# Altium schematic sheet Peripheral.SchDoc
size A3; Date: 01/12/2021; DrawnBy: Can Güveren; SheetNumber: 3; SheetTotal: 4; PageSize: A3
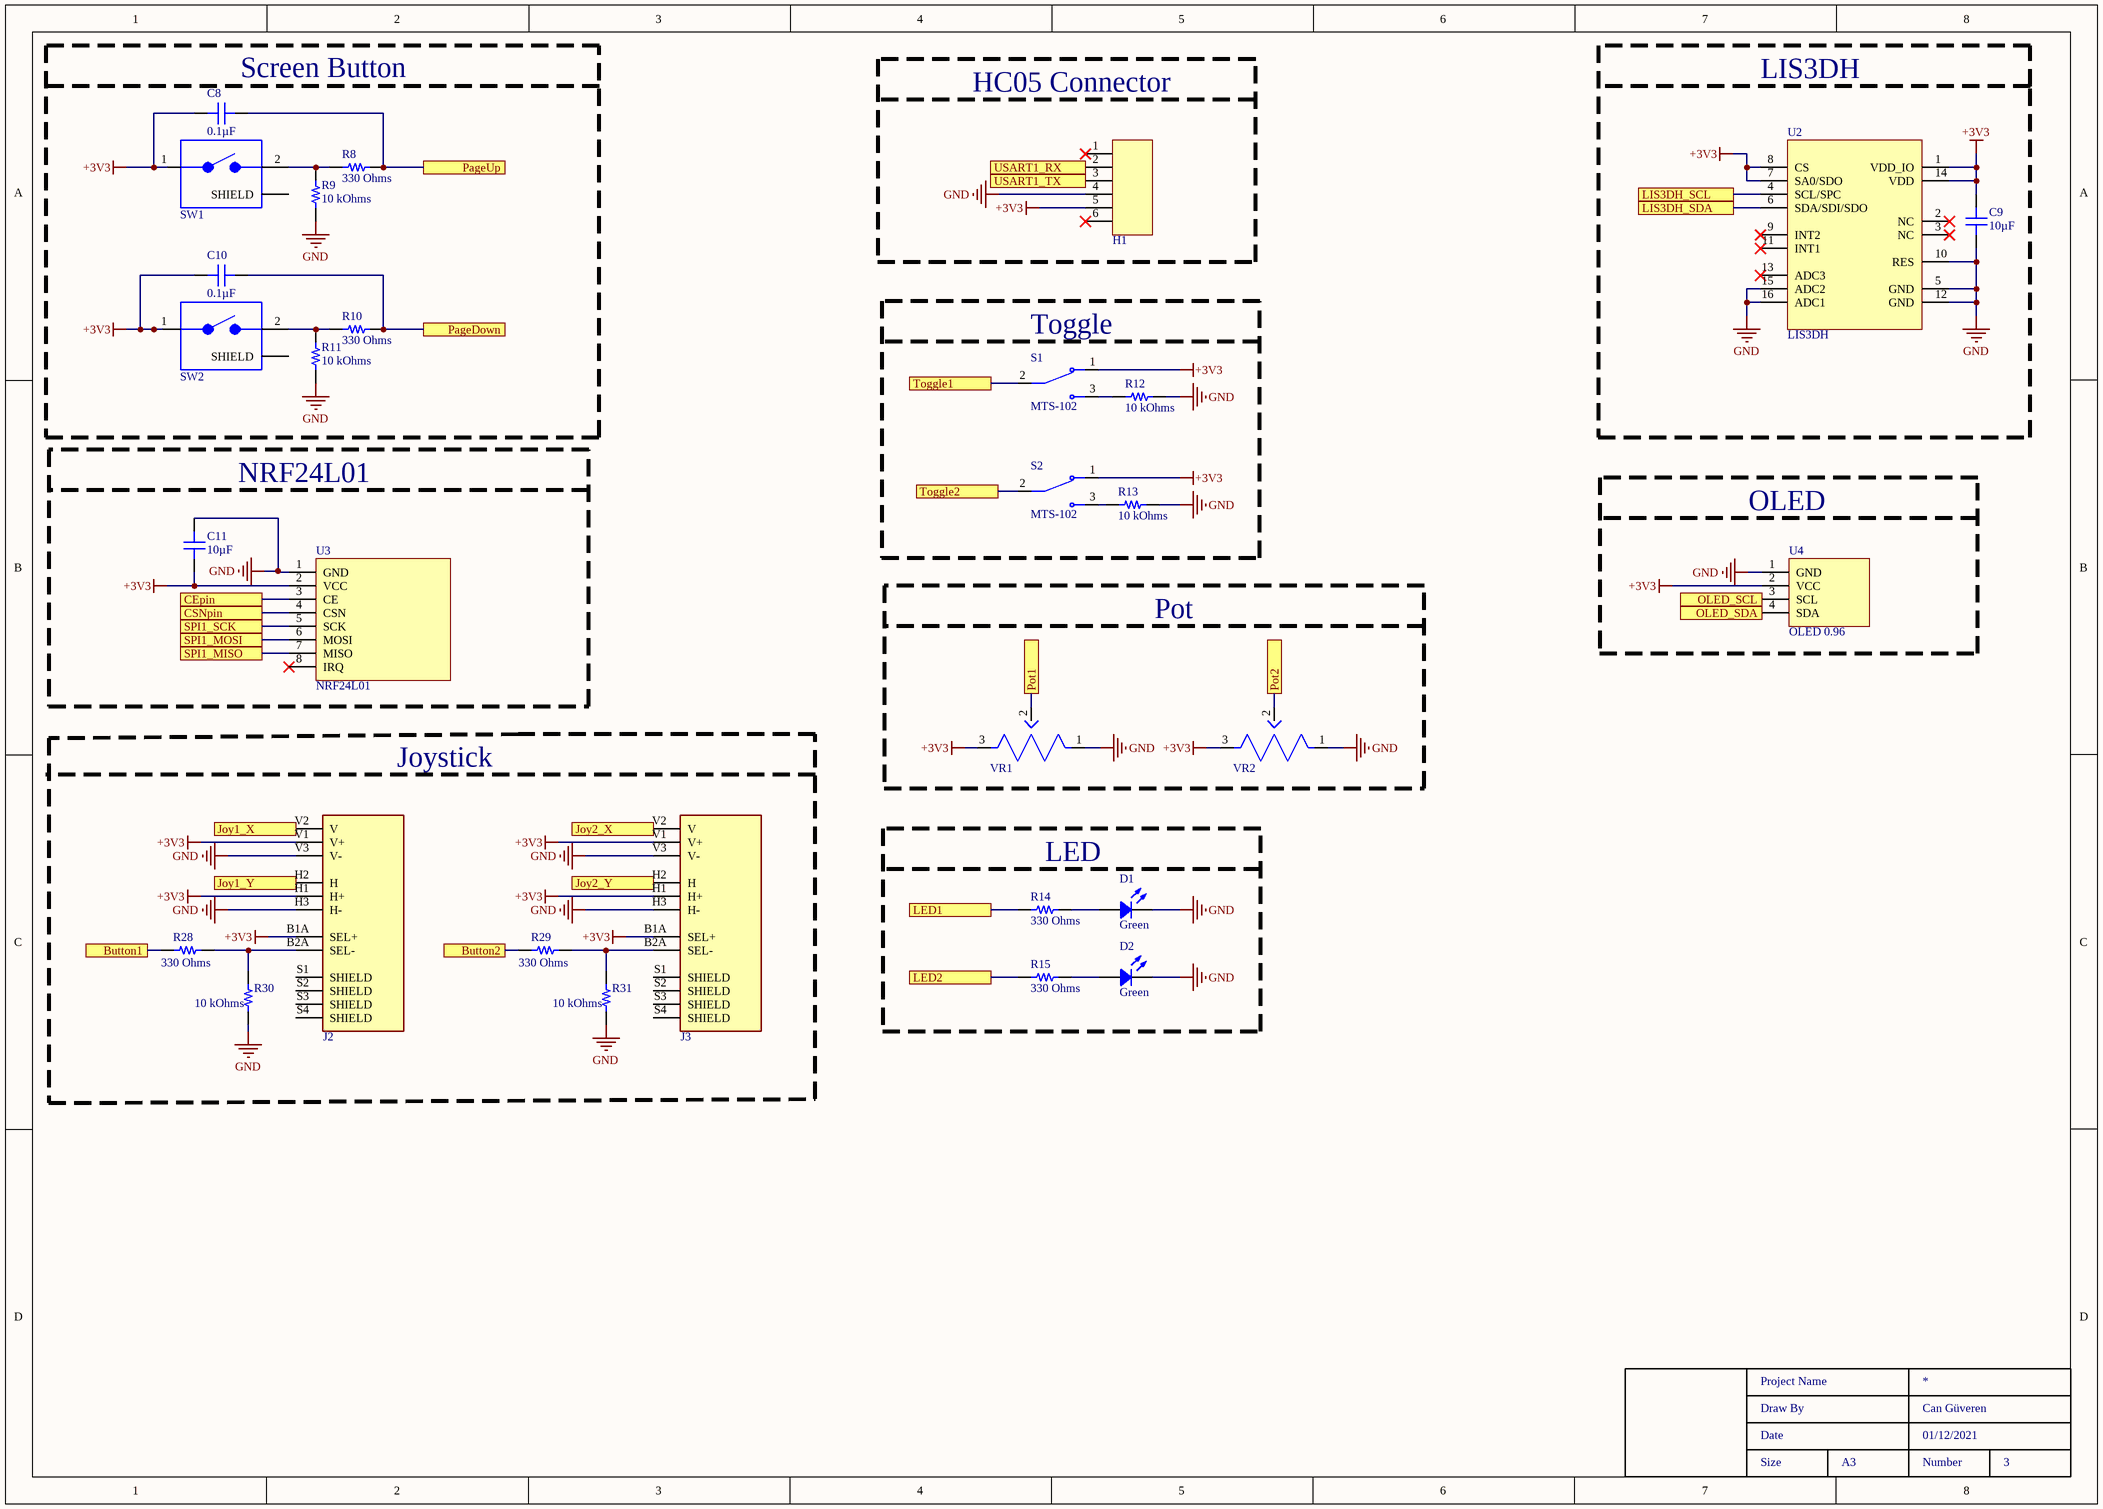
[diagram p0: Peripheral.SchDoc]

## Parts
C8  0.1µF  [CAP 0603_1608]
C9  10µF  [CAP 0603_1608]
C10  0.1µF  [CAP 0603_1608]
C11  10µF  [CAP 0603_1608]
D1  Green  [LED 1206_3216 YELLOW]
D2  Green  [LED 1206_3216 YELLOW]
H1  1x6 Pin Header - Female  [1x6 Pin Header - Female]  (value not drawn)
J2  COM-09032  [COM-09032]  (value not drawn)
J3  COM-09032  [COM-09032]  (value not drawn)
R8  330 Ohms  [RES 0603_1608]
R9  10 kOhms  [RES 0603_1608]
R10  330 Ohms  [RES 0603_1608]
R11  10 kOhms  [RES 0603_1608]
R12  10 kOhms  [RES 0603_1608]
R13  10 kOhms  [RES 0603_1608]
R14  330 Ohms  [RES 0603_1608]
R15  330 Ohms  [RES 0603_1608]
R28  330 Ohms  [RES 0603_1608]
R29  330 Ohms  [RES 0603_1608]
R30  10 kOhms  [RES 0603_1608]
R31  10 kOhms  [RES 0603_1608]
S1  MTS-102  [MTS-102 (Toggle)]
S2  MTS-102  [MTS-102 (Toggle)]
SW1  Switch Tactile, Right Angle  [Tactile Switch]  (value not drawn)
SW2  Switch Tactile, Right Angle  [Tactile Switch]  (value not drawn)
U2  LIS3DH  [VFLGA-16]
U3  NRF24L01  [NRF24L01+ PCB]
U4  OLED 0.96  [OLED 0.96]
VR1  PTV09A-4225F-B104  [PTV09A-4225F-B104]  (value not drawn)
VR2  PTV09A-4225F-B104  [PTV09A-4225F-B104]  (value not drawn)

## Blocks framed on the sheet
Screen Button: C8 C10 R8-R11 SW1 SW2
HC05 Connector: H1
LIS3DH: C9 U2
Toggle: R12 R13 S1 S2
NRF24L01: C11 U3
OLED: U4
Pot: VR1 VR2
Joystick: J2 J3 R28-R31
LED: D1 D2 R14 R15

## Ports
Button1, Button2, CEpin, CSNpin, Joy1_X, Joy1_Y, Joy2_X, Joy2_Y, LED1, LED2, LIS3DH_SCL, LIS3DH_SDA, OLED_SCL, OLED_SDA, PageDown, PageUp, Pot1, Pot2, SPI1_MISO, SPI1_MOSI, SPI1_SCK, Toggle1, Toggle2, USART1_RX, USART1_TX

## Nets
+3V3: C8.1 C9.2 C10.1 C11.1 H1.5 J2.B1A(SEL+) J2.H1(H+) J2.V1(V+) J3.B1A(SEL+) J3.H1(H+) J3.V1(V+) S1.1 S2.1 SW1.1 SW2.1 U2.1(VDD_IO) U2.7(SA0/SDO) U2.8(CS) U2.14(VDD) U3.2(VCC) U4.2(VCC) VR1.3 VR2.3
GND: C9.1 C11.2 D1.2 D2.2 H1.4 J2.H3(H-) J2.V3(V-) J3.H3(H-) J3.V3(V-) R9.1 R11.1 R12.1 R13.1 R30.1 R31.1 U2.5(GND) U2.10(RES) U2.12(GND) U2.15(ADC2) U2.16(ADC1) U3.1(GND) U4.1(GND) VR1.1 VR2.1
Button1: R28.1 ; port Button1
Button2: R29.1 ; port Button2
CEpin: U3.3(CE) ; port CEpin
CSNpin: U3.4(CSN) ; port CSNpin
Joy1_X: J2.V2(V) ; port Joy1_X
Joy1_Y: J2.H2(H) ; port Joy1_Y
Joy2_X: J3.V2(V) ; port Joy2_X
Joy2_Y: J3.H2(H) ; port Joy2_Y
LED1: R14.1 ; port LED1
LED2: R15.1 ; port LED2
LIS3DH_SCL: U2.4(SCL/SPC) ; port LIS3DH_SCL
LIS3DH_SDA: U2.6(SDA/SDI/SDO) ; port LIS3DH_SDA
OLED_SCL: U4.3(SCL) ; port OLED_SCL
OLED_SDA: U4.4(SDA) ; port OLED_SDA
PageDown: C10.2 R10.2 ; port PageDown
PageUp: C8.2 R8.2 ; port PageUp
Pot1: VR1.2 ; port Pot1
Pot2: VR2.2 ; port Pot2
SPI1_MISO: U3.7(MISO) ; port SPI1_MISO
SPI1_MOSI: U3.6(MOSI) ; port SPI1_MOSI
SPI1_SCK: U3.5(SCK) ; port SPI1_SCK
Toggle1: S1.2 ; port Toggle1
Toggle2: S2.2 ; port Toggle2
USART1_RX: H1.2 ; port USART1_RX
USART1_TX: H1.3 ; port USART1_TX
NetD1_1: D1.1 R14.2
NetD2_1: D2.1 R15.2
NetJ2_B2A: J2.B2A(SEL-) R28.2 R30.2
NetJ3_B2A: J3.B2A(SEL-) R29.2 R31.2
NetR8_1: R8.1 R9.2 SW1.2
NetR10_1: R10.1 R11.2 SW2.2
NetR12_2: R12.2 S1.3
NetR13_2: R13.2 S2.3
NetSW1_S1: SW1.S1(SHIELD) SW1.S2(SHIELD)
NetSW2_S1: SW2.S1(SHIELD) SW2.S2(SHIELD)

Not connected (* = marked no-connect by the designer): H1 1(0)* 6(5)*; J2 S1(SHIELD) S2(SHIELD) S3(SHIELD) S4(SHIELD); J3 S1(SHIELD) S2(SHIELD) S3(SHIELD) S4(SHIELD); U2 2(NC)* 3(NC)* 9(INT2)* 11(INT1)* 13(ADC3)*; U3 8(IRQ)*

## Notes on the sheet
- Project Name
- Draw By
- Date
- Size
- Number

## Library data of the parts
C8 C10 = C0603C104K5RAC7411: CAP CER 0.1UF 50V X7R 0603; Manufacturer: KEMET; Tolerance: ±10%; Part Number: C0603C104K5RAC7411; Value: 0.1µF; Applications: Bypass, Decoupling; Capacitance: 0.1µF; ComponentLink1Description: Datasheet; ComponentLink1URL: https://api.kemet.com/component-edge/download/datasheet/C0603C104K5RAC7411.pdf; ComponentLink2Description: DigiKey Link; ComponentLink2URL: http://digikey.com/product-detail/en/kemet/C0603C104K5RAC7411/399-7374-2-ND/3317013; Device Package: 0603 (1608 Metric); LastUpdated: 2.09.2020 01:03:36; Lifecycle Status: Active; Minimum Order: 15000; Mounting Type: Surface Mount, MLCC; Operating Temperature: -55°C ~ 125°C; Package / Case: 0603 (1608 Metric); Packaging: TapeAndReel; PartId: 2233; Part Status: Active; Price: 0.02; Series: SMD Comm X7R; Size / Dimension: 0.063" L x 0.031" W (1.60mm x 0.80mm); Supplier 1: DigiKey; Supplier Part Number 1: 399-7374-2-ND; Temperature Coefficient: X7R; Thickness (Max): 0.035" (0.90mm); Voltage - Rated: 50V
C9 C11 = GRM188R60J106ME47D: CAP CER 10UF 6.3V X5R 0603; Manufacturer: Murata Electronics; Tolerance: ±20%; Part Number: GRM188R60J106ME47D; Value: 10µF; Applications: General Purpose; Capacitance: 10µF; ComponentLink1Description: Datasheet; ComponentLink1URL: https://www.murata.com/~/media/webrenewal/support/library/catalog/products/capacitor/mlcc/c02e.ashx?la=en-us; ComponentLink2Description: DigiKey Link; ComponentLink2URL: http://digikey.com/product-detail/en/murata-electronics/GRM188R60J106ME47D/490-3896-1-ND/965938; Device Package: 0603 (1608 Metric); LastUpdated: 2.09.2020 01:03:35; Lifecycle Status: Active; Minimum Order: 1; Mounting Type: Surface Mount, MLCC; Operating Temperature: -55°C ~ 85°C; Package / Case: 0603 (1608 Metric); Packaging: TapeAndReel; PartId: 2351; Part Status: Active; Price: 0.03; Series: GRM; Size / Dimension: 0.063" L x 0.031" W (1.60mm x 0.80mm); Supplier 1: DigiKey; Supplier Part Number 1: 490-3896-1-ND; Temperature Coefficient: X5R; Thickness (Max): 0.035" (0.90mm); Voltage - Rated: 6.3V
D1 D2 = 5990240007F: LED YELLOW 1206 SMD; Manufacturer: Dialight; Configuration: Standard; Current - Test: 20mA; Lens Color: 0.80mm; Lens Size: 2.00mm x 1.60mm; Lens Style: Rectangle with Flat Top; Millicandela Rating: 126mcd; Viewing Angle: 140°; Voltage - Forward (Vf) (Typ): 2.1V; Wavelength - Dominant: 590nm; Part Number: 5990240007F; Color: Yellow; ComponentLink1Description: Datasheet; ComponentLink1URL: http://www.dialightsignalsandcomponents.com/Assets/Brochures_And_Catalogs/Indication/CBI_SMD_new/Dialight_CBI_data_599-1206_Apr2018.pdf; ComponentLink2Description: DigiKey Link; ComponentLink2URL: http://digikey.com/product-detail/en/dialight/5990240007F/350-4363-1-ND/9385469; Device Package: 1206 (3216 Metric); Height (Max): 0.80mm; LastUpdated: 2.09.2020 01:21:26; Lifecycle Status: Active; Minimum Order: 1; Mounting Type: Surface Mount; Package / Case: 1206 (3216 Metric); Packaging: TapeAndReel; PartId: 1; Part Status: Active; Price: 0.07; Series: 599; Size / Dimension: 3.20mm L x 1.60mm W; Supplier 1: DigiKey; Supplier Part Number 1: 350-4363-1-ND; Supplier Device Package: 1206; Value: Green
J2 J3 = COM-09032: Joystick 10K Ohm 2 Axis Th; Manufacturer: SparkFun; Supplier 1: Digi-Key; Manufacturer Part Number: COM-09032; RoHS: No; Stock 1: 1930; Pricing 1: 1=3,95000 (USD); ComponentLink1URL: https://media.digikey.com/pdf/Data%20Sheets/Sparkfun%20PDFs/COM-09032_Web.pdf?src-supplier=Digi-Key; ComponentLink1Description: https://media.digikey.com/pdf/Data%20Sheets/Sparkfun%20PDFs/COM-09032_Web.pdf?src-supplier=Digi-Key; Supplier Part Number 1: 1568-1526-ND
R8 R10 R14 R15 R28 R29 = AC0603FR-07330RL: RES SMD 330 OHM 1% 1/10W 0603; Manufacturer: Yageo; Power (Watts): 0.1W, 1/10W; Temperature Coefficient: ±100ppm/°C; Part Number: AC0603FR-07330RL; Value: 330 Ohms; ComponentLink1Description: Datasheet; ComponentLink1URL: https://www.yageo.com/upload/media/product/productsearch/datasheet/rchip/PYu-AC_51_RoHS_L_7.pdf; ComponentLink2Description: DigiKey Link; ComponentLink2URL: http://digikey.com/product-detail/en/yageo/AC0603FR-07330RL/YAG3595CT-ND/6006444; Composition: Thick Film; Device Package: 0603 (1608 Metric); Features: Automotive AEC-Q200, Moisture Resistant; Height - Seated (Max): 0.022" (0.55mm); LastUpdated: 2.09.2020 01:09:46; Lifecycle Status: Active; Minimum Order: 1; Number of Terminations: 2; Operating Temperature: -55°C ~ 155°C; Package / Case: 0603 (1608 Metric); Packaging: CutTape; PartId: 22572; Part Status: Active; Price: 0.10; Ratings: AEC-Q200; Resistance: 330 Ohms; Series: AC; Size / Dimension: 0.063" L x 0.031" W (1.60mm x 0.80mm); Supplier 1: DigiKey; Supplier Part Number 1: YAG3595CT-ND; Supplier Device Package: 0603; Tolerance: ±1%
R9 R11-R13 R30 R31 = RNCS0603BKE10K0: RES 10K OHM 0.1% 1/16W 0603; Manufacturer: Stackpole Electronics Inc; Power (Watts): 0.063W, 1/16W; Temperature Coefficient: ±25ppm/°C; Part Number: RNCS0603BKE10K0; Value: 10 kOhms; ComponentLink1Description: Datasheet; ComponentLink1URL: https://www.seielect.com/catalog/sei-rncs_rnch.pdf; ComponentLink2Description: DigiKey Link; ComponentLink2URL: http://digikey.com/product-detail/en/stackpole-electronics-inc/RNCS0603BKE10K0/RNCS0603BKE10K0CT-ND/1800113; Composition: Thin Film; Device Package: 0603 (1608 Metric); Features: Anti-Corrosive, Automotive AEC-Q200, Moisture Resistant; Height - Seated (Max): 0.022" (0.55mm); LastUpdated: 2.09.2020 01:10:25; Lifecycle Status: Active; Minimum Order: 1; Number of Terminations: 2; Operating Temperature: -55°C ~ 155°C; Package / Case: 0603 (1608 Metric); Packaging: TapeAndReel; PartId: 4838; Part Status: Active; Price: 0.08; Ratings: AEC-Q200; Resistance: 10 kOhms; Series: RNCS; Size / Dimension: 0.061" L x 0.031" W (1.55mm x 0.80mm); Supplier 1: DigiKey; Supplier Part Number 1: RNCS0603BKE10K0CT-ND; Supplier Device Package: 0603; Tolerance: ±0.1%
U2 = LIS3DH: MEMS digital output motion sensor ultra low-power high performance 3-axes "nano" accelerometer; Manufacturer: STMicroelectronics; Bandwidth: 5kHz; Interface: I2C,SPI; Axis: X, Y, Z; Sensor Type: 3 Axis; Min Supply Voltage: 1.71V; Max Supply Voltage: 3.6V; Resolution: 16b; Operating Supply Voltage: 2.5V; Operating Supply Current: 11uA; Supplier 1: Digi-Key; Manufacturer Part Number: LIS3DH; RoHS: Yes; Category: Accelerometers; Case/Package: LGA; Number of Pins: 16; Min Operating Temperature: -40°C; Max Operating Temperature: 85°C; Package Quantity: 490; Packaging: Tray; Output Type: Digital; Series: LIS3DH; Max Supply Voltage (DC): 3.6V; Min Supply Voltage (DC): 1.71V; Length: 3mm; Width: 3mm; Height: 1mm; Depth: 3mm; Radiation Hardening: No; Lead Free: Lead Free; REACH SVHC: No SVHC; RoHS Compliant: Yes; ComponentLink1URL: https://datasheet.ciiva.com/26928/lis3dh-26928591.pdf?src-supplier=IIIC; ComponentLink1Description: https://datasheet.ciiva.com/26928/lis3dh-26928591.pdf?src-supplier=IIIC; ComponentLink2URL: https://datasheet.ciiva.com/1166/1834384-1166167.pdf?src-supplier=Element14; ComponentLink2Description: https://datasheet.ciiva.com/1166/1834384-1166167.pdf?src-supplier=Element14; ComponentLink3URL: https://datasheet.ciiva.com/2810/cd00274221-2810007.pdf?src-supplier=Digi-Key; ComponentLink3Description: https://datasheet.ciiva.com/2810/cd00274221-2810007.pdf?src-supplier=Digi-Key; ComponentLink4URL: https://datasheet.ciiva.com/16638/cd00274221-16638201.pdf?src-supplier=Avnet+Europe; ComponentLink4Description: https://datasheet.ciiva.com/16638/cd00274221-16638201.pdf?src-supplier=Avnet+Europe; ComponentLink5URL: https://datasheet.ciiva.com/5296/cd00274221-470704-5296509.pdf?src-supplier=Mouser; ComponentLink5Description: https://datasheet.ciiva.com/5296/cd00274221-470704-5296509.pdf?src-supplier=Mouser; Supplier Part Number 1: 497-10610-ND
U3 = NRF24L01+ PCB
VR1 VR2 = PTV09A-4225F-B104: Res Carbon Film POT 100K Ohm 20% 1/20W 1(Elec)/1(Mech)Turn 6mm (11.4 X 12.65 X 28.8mm) Pin Bracket Mount/Through Hole; Manufacturer: Bourns; Resistance: 100kR; Number of Turns: 1; Max Power Dissipation: 50mW; Actuator Length: 0.984inch; Actuator Diameter: 0.236inch; Hole Diameter: 9.1mm; Supplier 1: Digi-Key; Manufacturer Part Number: PTV09A-4225F-B104; RoHS: Yes; Category: Variable Resistors and Potentiometers; Stock 1: 376; Pricing 1: 1=0,83000, 10=0,74400, 25=0,67200, 40=0,64800, 100=0,61200, 300=0,58800, 500=0,55200, 1000=0,45600, 4900=0,37200 (USD); Mount: Through Hole,Snap in,Brackets,Horizontal; Min Operating Temperature: -10°C; Max Operating Temperature: 50°C; Tolerance: 20%; Package Quantity: 100; Packaging: Bulk; Taper: Linear; Termination: Pin; Number of Gangs: 1; Resistor Type: Carbon; Type: Potentiometer; Series: Pro Audio PTV09; Technology: CARBON FILM; Power Rating: 50mW; Length: 11.4mm; Height: 12.5mm; Depth: 12.5mm; Radiation Hardening: No; RoHS Compliant: Yes; Military Standard: Not; REACH SVHC: No SVHC; ComponentLink1URL: https://datasheet.ciiva.com/6249/ptv09-6249573.pdf?src-supplier=Digi-Key; ComponentLink1Description: https://datasheet.ciiva.com/6249/ptv09-6249573.pdf?src-supplier=Digi-Key; Supplier Part Number 1: PTV09A-4225F-B104-ND
S1 S2 = MTS-102: ComponentLink1URL: https://datasheet.ciiva.com/24455/t111597-24455739.pdf?src-supplier=Onlinecomponents.com; ComponentLink1Description: https://datasheet.ciiva.com/24455/t111597-24455739.pdf?src-supplier=Onlinecomponents.com; ComponentLink2URL: https://datasheet.ciiva.com/2905/t111597-2905494.pdf?src-supplier=Digi-Key; ComponentLink2Description: https://datasheet.ciiva.com/2905/t111597-2905494.pdf?src-supplier=Digi-Key